# EAGLE design SNES_RGBAmp (EAGLE 7.7.0)
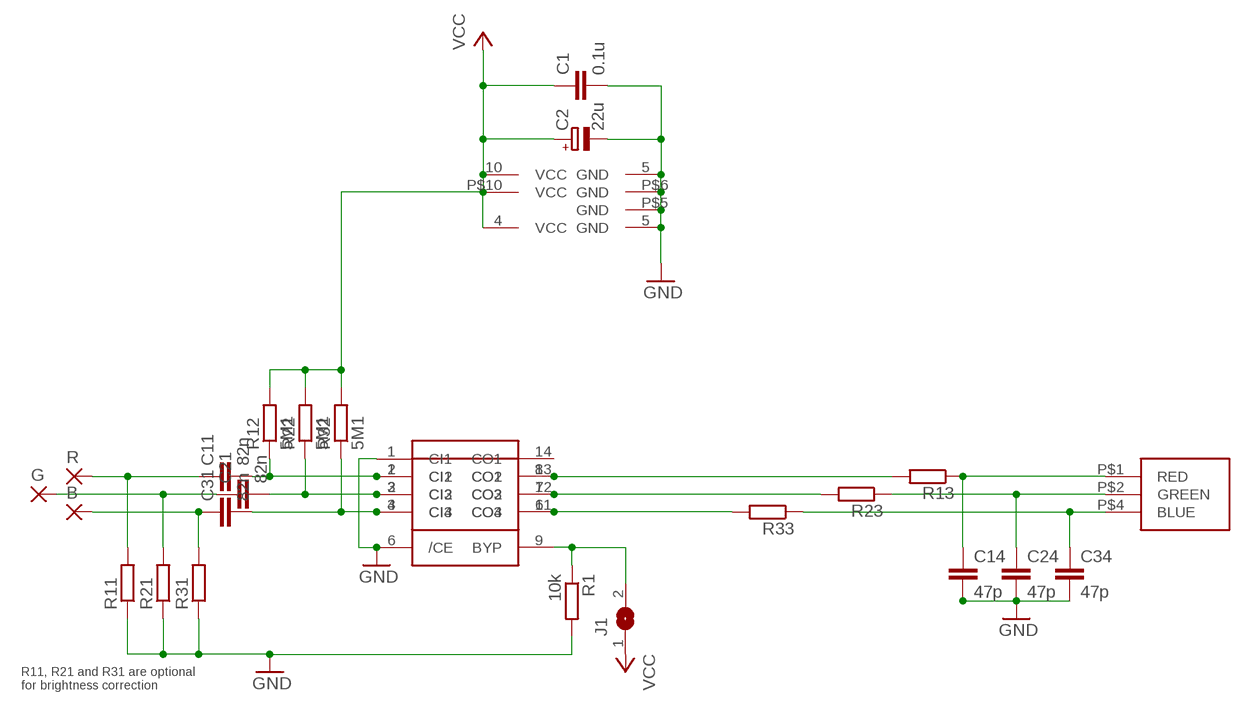
[diagram p0: schematic, sheet 1]

## Parts
B  SMD2  [SMD1,27-2,54]
C1  0.1u  C-EUC0603K  [C0603K]
C2  22u  CPOL-EUSMCB  [SMC_B]
C11  82n  C-EUC0603K  [C0603K]
C14  47p  C-EUC0603K  [C0603K]
C21  82n  C-EUC0603K  [C0603K]
C24  47p  C-EUC0603K  [C0603K]
C31  82n  C-EUC0603K  [C0603K]
C34  47p  C-EUC0603K  [C0603K]
G  SMD2  [SMD1,27-2,54]
J1  SJ  [SJ]
R  SMD2  [SMD1,27-2,54]
R1  10k  R-EU_R0603  [R0603]
R11  R-EU_R0603  [R0603]
R12  5M1  R-EU_R0603  [R0603]
R13  R-EU_R0603  [R0603]
R21  R-EU_R0603  [R0603]
R22  5M1  R-EU_R0603  [R0603]
R23  R-EU_R0603  [R0603]
R31  R-EU_R0603  [R0603]
R32  5M1  R-EU_R0603  [R0603]
R33  R-EU_R0603  [R0603]
U1  THS7374  [THS7374]
U$1  SNES_MULTIAV_RGB_ONLY  [SNES_MULTIAV_RGB_ONLY]
U$2  THS7314  [THS7314]

## Nets
GND: C1.2 C2.- C14.2 C24.2 C34.2 R1.2 R11.1 R21.1 R31.1 U1.1(CI1) U1.5(GND) U1.6(/CE) U$1.P$5(GND) U$1.P$6(GND) U$2.5(GND)
N$1: C11.2 R12.1 U1.2(CI2) U$2.1(CI1)
N$2: C21.2 R22.1 U1.3(CI3) U$2.2(CI2)
N$3: J1.2 R1.1 U1.9(BYP)
N$4: R23.2 U1.12(CO3) U$2.7(CO2)
N$5: C14.1 R13.1 U$1.P$1(RED)
N$6: C24.1 R23.1 U$1.P$2(GREEN)
N$7: R13.2 U1.13(CO2) U$2.8(CO1)
N$8: R33.2 U1.11(CO4) U$2.6(CO3)
N$9: C34.1 R33.1 U$1.P$4(BLUE)
N$14: C11.1 R11.2 R.1(P)
N$15: C21.1 G.1(P) R21.2
N$16: B.1(P) C31.1 R31.2
R9: C31.2 R32.1 U1.4(CI4) U$2.3(CI3)
VCC: C1.1 C2.+ J1.1 R12.2 R22.2 R32.2 U1.10(VCC) U$1.P$10(VCC) U$2.4(VCC)
Unconnected: U1.14(CO1)

## Notes on the sheet
- R11, R21 and R31 are optional
  for brightness correction

## Library data of the parts
B G R = wirepad:SMD2: SMD PAD
C1 C11 C14 C21 C24 C31 C34 = rcl:C-EU: CAPACITOR, European symbol
C2 = rcl:CPOL-EU: POLARIZED CAPACITOR, European symbol
J1 = jumper:SJ: SMD solder JUMPER
R1 R11-R13 R21-R23 R31-R33 = rcl:R-EU_: RESISTOR, European symbol
U1 = snes_div:THS7374
U$1 = snes_div:SNES_MULTIAV_RGB_ONLY
U$2 = snes_div:THS7314

## Board
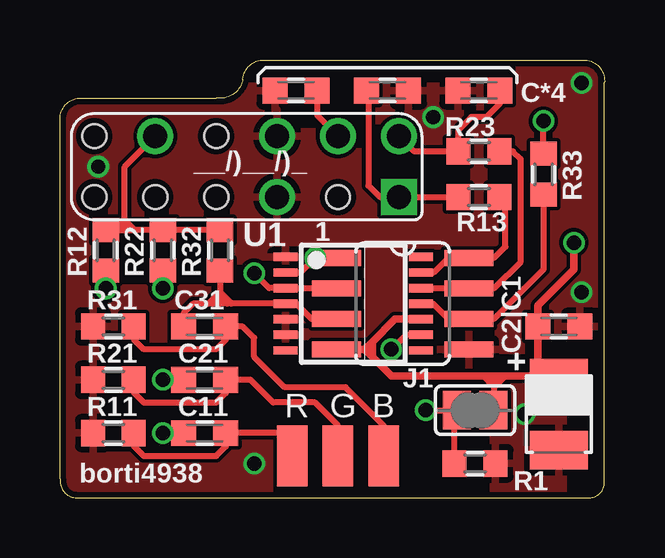
[diagram p1: board, top side]
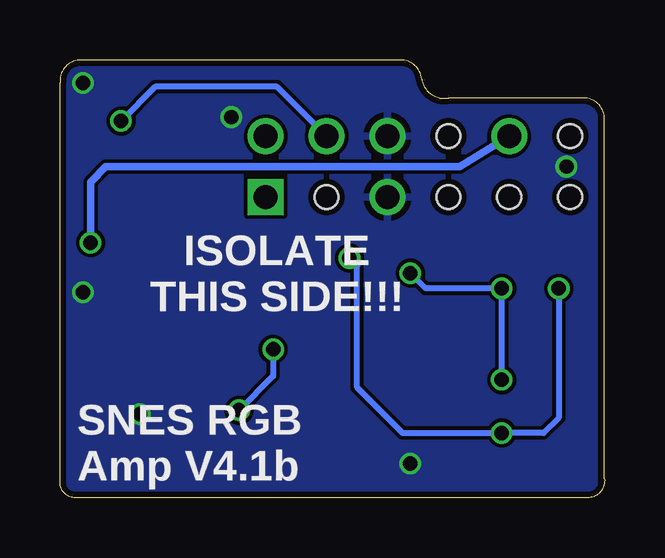
[diagram p2: board, bottom side, seen from below]

Size 22.71 x 18.26 mm. Coordinates in mm from the lower left corner, seen from the top.
Outline: 0.64,0 22.07,0 arc90 22.71,0.64 22.71,17.3 arc90 21.91,18.26 8.58,18.26 arc90 7.62,17.46 arc-90 6.51,16.67 0.96,16.67 arc90 0,15.88 0,0.79 arc90 0.64,0
Copper layers (1*16): Top 0.035mm / dielectric 1.5mm / Bottom 0.035mm
Design rules "ITEADstudio_DRC": minimum track width 6mil, minimum drill 12mil, track to track 6mil, track to pad 6mil, pad to pad 6mil, via to via 6mil, smd to smd 0mil, copper to edge 10mil, drill to drill 10mil, minimum pad ring 10mil, minimum via ring 6mil, stop-mask expansion 2mil, vias tented up to drill 30mil, thermal gap 10mil
tRestrict: area 19.7,12.9 to 20.6,14; area 1.4,9 to 7.1,11.6; area 7.1,4.9 to 8.9,8.7; area 15.1,0.3 to 17.8,3; area 21.3,0.3 to 22.4,4.3; area 1.8,2.1 to 3.2,6.8; area 7.9,17.5 to 18.9,18.6; area 9.4,15.6 to 12.2,17.5; area 17.9,13 to 19.4,14; area 15.6,13 to 17,14; area 10.5,7.8 to 12.5,10.3; area 17.9,5.2 to 22.5,6.5

### Footprints (pad centres in the part's own frame; a part is rotated, then mirrored left to right if it is on the bottom)
SMD1,27-2,54 = smd 1.27 x 2.54: 1 0,0
C0603K = smd 1.05 x 1.08: 1 -0.875,0; 2 0.875,0
SMC_B = smd 1.6 x 2.4: + -1.5,0; - 1.5,0
SJ = smd 1.168 x 1.6: 1 -0.762,0; 2 0.762,0
R0603 = smd 1 x 1.1: 1 -0.85,0; 2 0.85,0
THS7374 = smd 0.35 x 1: 1 -1.95,-2.825; 2 -1.3,-2.825; 3 -0.65,-2.825; 4 0,-2.825; 5 0.65,-2.825; 6 1.3,-2.825; 7 1.95,-2.825; 8 1.95,2.825; 9 1.3,2.825; 10 0.65,2.825; 11 0,2.825; 12 -0.65,2.825; 13 -1.3,2.825; 14 -1.95,2.825
SNES_MULTIAV_RGB_ONLY = drill 1 square: P$1 6.35,-1.27 | drill 1: P$2 6.35,1.27; P$4 3.81,1.27; P$5 1.27,-1.27; P$6 1.27,1.27; P$10 -3.81,1.27 | hole 1: 3.81,-1.27; -1.27,1.27; -1.27,-1.27; -3.81,-1.27; -6.35,-1.27; -6.35,1.27
THS7314 = smd 0.66 x 2.032: 1 -1.905,-2.756; 2 -0.635,-2.756; 3 0.635,-2.756; 4 1.905,-2.756; 5 1.905,2.756; 6 0.635,2.756; 7 -0.635,2.756; 8 -1.905,2.756

### Placement (x,y rotation side)
B  13.5,1.75 0 top
C1  20.8,7.14 0 top
C2  20.8,3.49 270 top
C11  6.04,2.7 180 top
C14  13.66,16.99 0 top
C21  6.04,4.92 180 top
C24  17.47,16.99 180 top
C31  6.04,7.14 180 top
C34  9.85,16.99 180 top
G  11.59,1.75 0 top
J1  17.31,3.65 180 top
R  9.69,1.75 0 top
R1  17.31,1.43 0 top
R11  2.23,2.7 0 top
R12  1.91,10.32 90 top
R13  17.47,12.54 0 top
R21  2.23,4.92 0 top
R22  4.29,10.32 90 top
R23  17.47,14.45 0 top
R31  2.23,7.14 0 top
R32  6.67,10.32 90 top
R33  20.17,13.49 270 top
U1  12.23,8.1 270 top
U$1  7.78,13.81 0 top
U$2  14.29,8.1 270 top

### Tracks (layer width: path | path; a pad name or v marks a point on that pad's centre or on a via)
GND  (via drill 0.6)
  other vias: 21.75,8.57 1.59,13.81 21.75,17.3 15.56,15.88 19.37,3.49 8.1,1.43
  pour Bottom: -1.74,-0.16 23.66,-0.16 23.66,21.43 -1.74,21.43
  pour Top: -1.74,-0.16 23.66,-0.16 23.66,21.43 -1.74,21.43
N$1  (via drill 0.6)
  Top 0.254: v4.29,2.7 C11.2 | R12.1 v1.91,8.73 | U1.2 10.04,9.4 v10.64,10 U$2.1
  Bottom 0.254: v1.91,8.73 1.91,3.33 2.54,2.7 v4.29,2.7 8.42,2.7 10.32,4.6 10.32,9.68 v10.64,10
N$2  (via drill 0.6)
  Top 0.254: C21.2 v4.29,4.92 | v4.29,8.73 R22.1 | U$2.2 11.52,8.75 U1.3 8.72,8.75 v8.1,9.37
  Bottom 0.254: v4.29,4.92 v4.29,8.73 7.47,8.73 v8.1,9.37
N$3  (via drill 0.6)
  Top 0.254: 16.51,3.68 J1.2 16.04,3.65 | U1.9 14.42,6.8 v13.82,6.19 | v15.24,3.65 16.04,3.65 | R1.1 16.46,3.23 16.04,3.65
  Bottom 0.254: v13.82,6.19 13.82,5.08 v15.24,3.65
N$4
  Top 0.254: R23.2 18.9,14.45 19.21,14.13 19.21,9.84 18.1,8.73 U$2.7 17.03,8.75 U1.12
N$5
  Top 0.254: C14.1 12.86,16.99 12.86,13.02 13.34,12.54 U$1.P$1 R13.1
N$6
  Top 0.254: U$1.P$2 14.77,14.45 R23.1 16.62,15.34 17.15,15.88 17.78,15.88 18.34,16.43 C24.1
N$7
  Top 0.254: U1.13 15.59,9.4 16.2,10 U$2.8 18.1,10 18.58,10.48 18.58,12.28 R13.2
N$8
  Top 0.254: U1.11 15.56,8.1 16.2,7.46 U$2.6 18.1,7.46 20.17,9.53 R33.2
N$9  (via drill 0.6)
  Top 0.254: R33.1 v20.17,15.72 | C34.1 10.72,15.95 U$1.P$4
  Bottom 0.254: U$1.P$4 13.66,17.15 18.74,17.15 v20.17,15.72
N$14
  Top 0.254: R11.2 3.08,2.17 3.5,1.75 6.51,1.75 6.91,2.15 C11.1 9.69,2.7 R.1
N$15
  Top 0.254: G.1 11.59,3.02 10.64,3.97 8.89,3.97 7.94,4.92 C21.1 6.91,4.37 6.51,3.97 3.5,3.97 3.08,4.39 R21.2
N$16
  Top 0.254: B.1 13.5,3.02 11.91,4.6 9.37,4.6 8.1,5.87 8.1,6.67 7.62,7.14 C31.1 | 6.51,7.46 C31.1 | R31.2 3.08,6.61 3.5,6.19 6.51,6.19 6.91,6.59 C31.1
R9
  Top 0.254: U$2.3 10.48,7.46 9.85,8.1 U1.4 7.15,8.1 | 6.99,8.1 6.67,8.1 | C31.2 5.16,7.7 5.56,8.1 6.2,8.1 | R32.1 6.67,8.57 | 6.67,8.57 6.67,8.1 | 6.67,8.1 6.35,8.1 | 6.35,8.1 6.2,8.1 | 6.2,8.1 6.67,8.57 | 6.67,8.57 7.15,8.1 | 7.15,8.1 6.99,8.1 | 6.99,8.1 6.83,8.26 6.51,8.26 6.35,8.1
VCC  (via drill 0.6)
  Top 0.254: R12.2 3.12,11.17 | R32.2 R22.2 3.12,11.17 | 17.63,5.08 18.1,4.6 18.58,5.08 18.1,5.08 18.26,4.92 | 18.1,4.92 18.1,3.68 J1.1 | U$1.P$10 2.7,13.81 2.7,11.27 2.39,11.27 2.7,11.59 3.12,11.17
  Top 0.305: U1.10 15.04,7.46 13.97,7.46 13.02,6.51 | 20.17,4.92 20.01,4.92 19.93,5 C1.1 19.93,8.02 21.44,9.53 v21.44,10.64 | 20.17,4.92 20.73,4.92 C2.+ 20.71,5.08 18.1,5.08 | U$2.4 12.7,6.19 | 18.1,5.08 17.63,5.08 13.82,5.08 13.02,5.87 | 20.01,5.08 20.17,4.92 | 18.1,5.08 18.07,5.05 18.07,4.95 18.1,4.92 | 13.02,6.51 12.7,6.19 | 12.7,6.19 13.02,5.87 | 13.02,6.51 13.02,5.87
  Bottom 0.305: v21.44,10.64 21.44,13.18 20.8,13.81 6.04,13.81 U$1.P$10

### Text on the board
tPlace: __/)__/)_ | U1 | J1 | borti4938
tNames: C*4 | R23 | R33 | 1 | R13 | R12 | R22 | R32 | R31 | C31 | R21 | C21 | + | C2|C1 | R11 | C11 | R1
bNames: ISOLATE / THIS SIDE!!! | SNES RGB / Amp V4.1b